# EAGLE schematic IOTPanel (EAGLE 7.3.0)
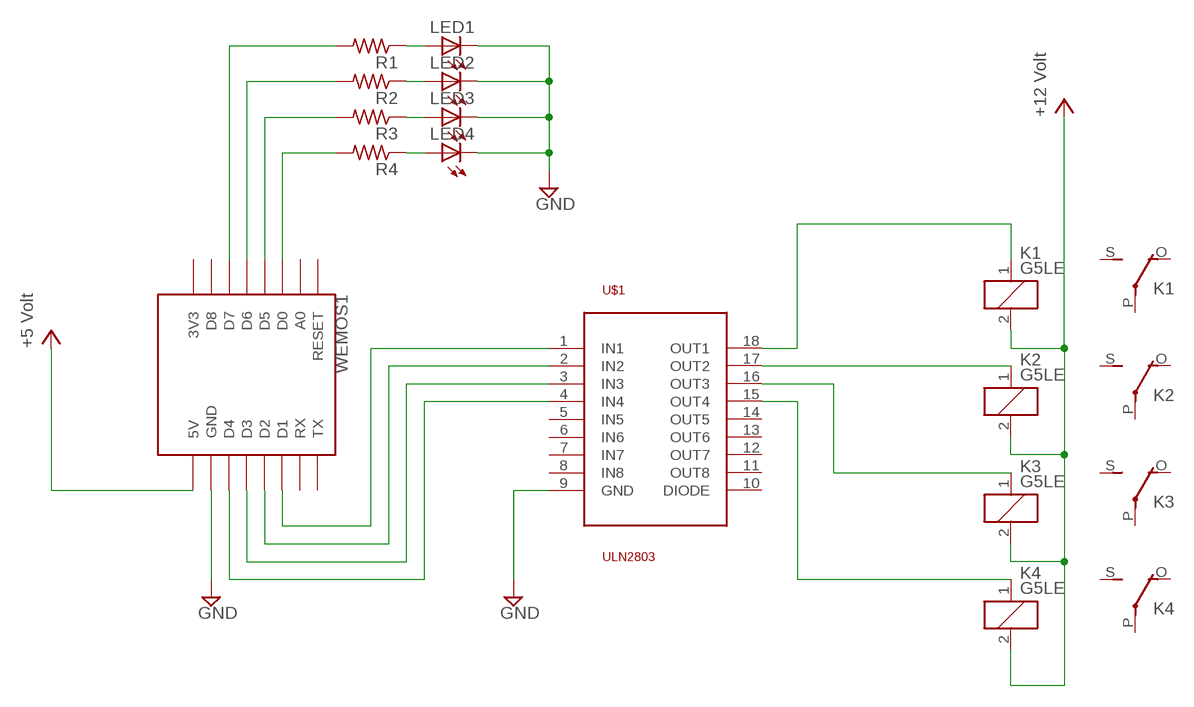
[diagram p0: schematic, sheet 1]

## Parts
K1  G5LE  [G5LE]
K2  G5LE  [G5LE]
K3  G5LE  [G5LE]
K4  G5LE  [G5LE]
LED1  LED  [SMARTLED-TTW]
LED2  LED  [SMARTLED-TTW]
LED3  LED  [SMARTLED-TTW]
LED4  LED  [SMARTLED-TTW]
R1  R-US_0204/2V  [0204V]
R2  R-US_0204/2V  [0204V]
R3  R-US_0204/2V  [0204V]
R4  R-US_0204/2V  [0204V]
U$1  ULN2803  [SO18L]
WEMOS1  WEMOS-D1-MINI  [WEMOS-D1-MINI]

## Nets
GND: LED1.C@1(C) LED2.C@1(C) LED3.C@1(C) LED4.C@1(C) U$1.9(GND) WEMOS1.GND
N$1: LED1.A@1(A) R1.1
N$2: LED2.A@1(A) R2.1
N$3: LED3.A@1(A) R3.1
N$4: LED4.A@1(A) R4.1
N$5: U$1.1(IN1) WEMOS1.D1
N$6: R1.2 WEMOS1.D7
N$7: R2.2 WEMOS1.D6
N$8: R3.2 WEMOS1.D5
N$9: R4.2 WEMOS1.D0
N$10: K1.1 U$1.18(OUT1)
N$11: K2.1 U$1.17(OUT2)
N$12: K3.1 U$1.16(OUT3)
N$13: K4.1 U$1.15(OUT4)
N$14: U$1.2(IN2) WEMOS1.D2
N$15: U$1.3(IN3) WEMOS1.D3
N$16: U$1.4(IN4) WEMOS1.D4
VCC: K1.2 K2.2 K3.2 K4.2 WEMOS1.5V ; supply symbol labelled +12 Volt, +5 Volt
Unconnected: K1.O(2:O) K1.P(2:P) K1.S(2:S) K2.O(2:O) K2.P(2:P) K2.S(2:S) K3.O(2:O) K3.P(2:P) K3.S(2:S) K4.O(2:O) K4.P(2:P) K4.S(2:S) U$1.5(IN5) U$1.6(IN6) U$1.7(IN7) U$1.8(IN8) U$1.10(DIODE) U$1.11(OUT8) U$1.12(OUT7) U$1.13(OUT6) U$1.14(OUT5) WEMOS1.3V3 WEMOS1.A0 WEMOS1.D8 WEMOS1.RESET WEMOS1.RX WEMOS1.TX

## Library data of the parts
K1-K4 = relay:G5LE: RELAY 1 x switch, 10 A/120 V AC, 8 A/30 V DC, Omron; OC_FARNELL: unknown; OC_NEWARK: unknown
LED1-LED4 = adafruit:LED: LED OSRAM: - CHIPLED LG R971, LG N971, LY N971, LG Q971, LY Q971, LO R971, LY R971 LH N974, LH R974 LS Q976, LO Q976, LY Q976 LO Q996 - Hyper CHIPLED LW Q18S LB Q993, LB Q99A, LB R99A - SideLED LS A670, LO A670, LY A670, LG A670, LP A670 LB A673, LV A673, LT A673, LW A673 LH A674 LY A675 LS A676, LA A676, LO A676, LY A676, LW A676 LS A679, LY A679, LG A679 - Hyper Micro SIDELED® LS Y876, LA Y876, LO Y876, LY Y876 LT Y87S - SmartLED LW L88C, LW L88S LB L89C, LB L89S, LG L890 LS L89K, LO L89K, LY L89K LS L896, LA L896, LO L896, LY L896 - TOPLED LS T670, LO T670, LY T670, LG T670, LP T670 LSG T670, LSP T670, LSY T670, LOP T670, LYG T670 LG T671, LOG T671, LSG T671 LB T673, LV T673, LT T673, LW T673 LH T674 LS T676, LA T676, LO T676, LY T676, LB T676, LH T676, LSB T676, LW T676 LB T67C, LV T67C, LT T67C, LS T67K, LO T67K, LY T67K, LW E67C LS E67B, LA E67B, LO E67B, LY E67B, LB E67C, LV E67C, LT E67C LW T67C LS T679, LY T679, LG T679 LS T770, LO T770, LY T770, LG T770, LP T770 LB T773, LV T773, LT T773, LW T773 LH T774 LS E675, LA E675, LY E675, LS T675 LS T776, LA T776, LO T776, LY T776, LB T776 LHGB T686 LT T68C, LB T68C - Hyper Mini TOPLED® LB M676 - Mini TOPLED Santana® LG M470 LS M47K, LO M47K, LY M47K Source: http://www.osram.convergy.de/
R1-R4 = adafruit:R-US_: RESISTOR, American symbol
U$1 = uln2803:ULN2803
WEMOS1 = esp8266modules:WEMOS-D1-MINI: WeMos.cc D1 mini ESP8266 module